# Altium schematic sheet SSR.SchDoc
size A
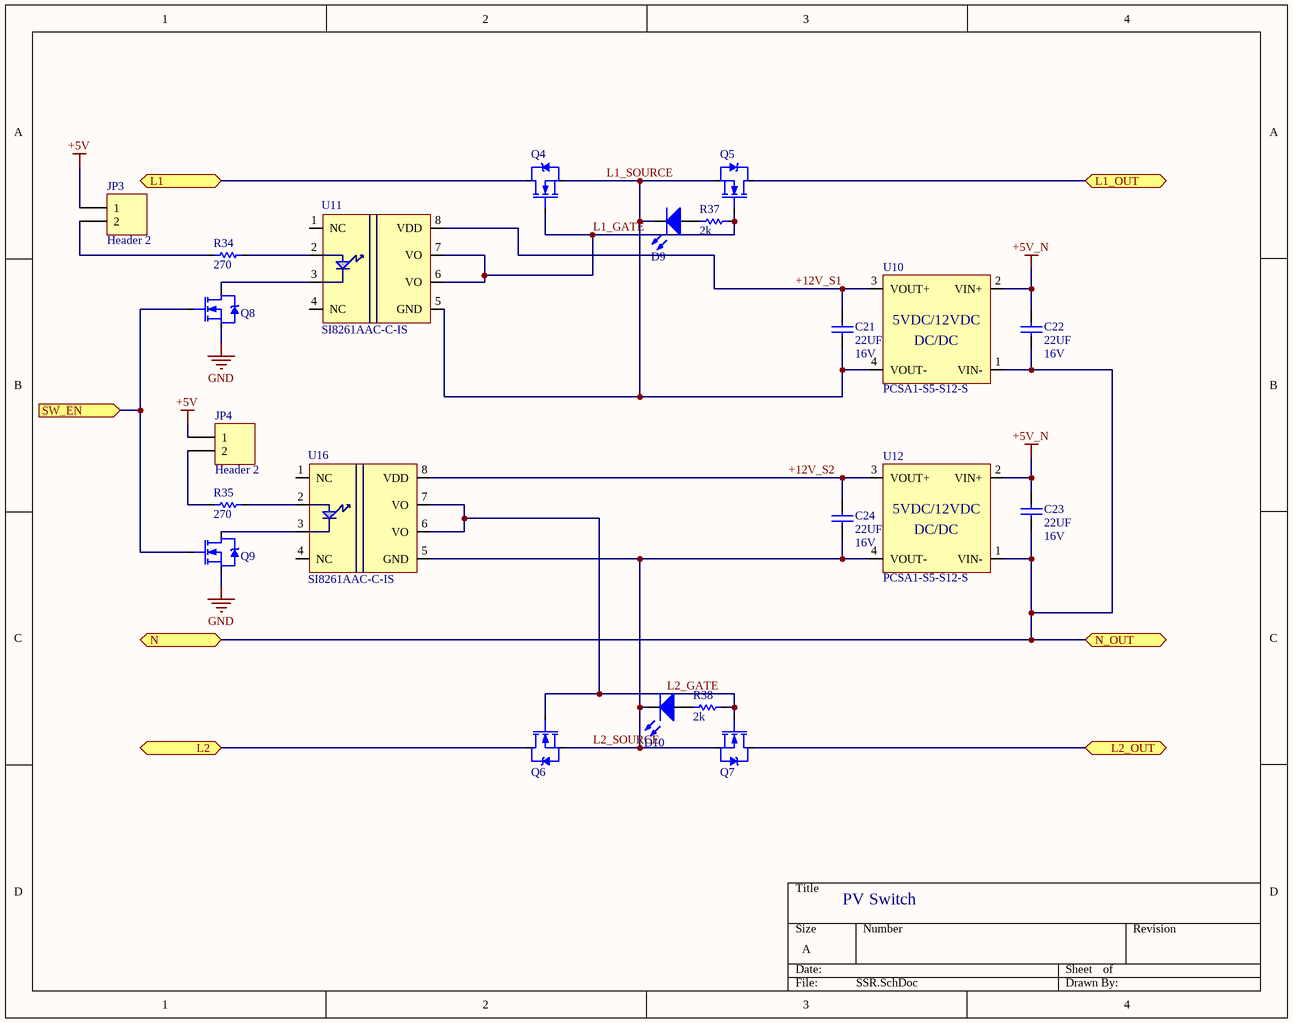
[diagram p0: SSR.SchDoc]

## Parts
C21  Capacitance: 22UF  Voltage - Rated: 16V  [CAPC3216X16N]  (hidden comment: GRM31CR61C226KE15K)
C22  Capacitance: 22UF  Voltage - Rated: 16V  [CAPC3216X16N]  (hidden comment: GRM31CR61C226KE15K)
C23  Capacitance: 22UF  Voltage - Rated: 16V  [CAPC3216X16N]  (hidden comment: GRM31CR61C226KE15K)
C24  Capacitance: 22UF  Voltage - Rated: 16V  [CAPC3216X16N]  (hidden comment: GRM31CR61C226KE15K)
D9  LTST-C190KGKT  [0603 LED]  (value not drawn)
D10  LTST-C190KGKT  [0603 LED]  (value not drawn)
JP3  Header 2  [HDR1X2]
JP4  Header 2  [HDR1X2]
Q4  STB42N60M2-EP  [D2PAK]  (value not drawn)
Q5  STB42N60M2-EP  [D2PAK]  (value not drawn)
Q6  STB42N60M2-EP  [D2PAK]  (value not drawn)
Q7  STB42N60M2-EP  [D2PAK]  (value not drawn)
Q8  NTR5103NT1G  [SOT95P237X111-3N]  (value not drawn)
Q9  NTR5103NT1G  [SOT95P237X111-3N]  (value not drawn)
R34  Resistance: 270  [RESC1608X06N]  (hidden comment: RC0603JR-07270RL)
R35  Resistance: 270  [RESC1608X06N]  (hidden comment: RC0603JR-07270RL)
R37  Resistance: 2k  [RESC1608X06N]  (hidden comment: RC0603FR-072KL)
R38  Resistance: 2k  [RESC1608X06N]  (hidden comment: RC0603FR-072KL)
U10  PCSA1-S5-S12-S  [PCSA1-S5-S12-S]
U11  SI8261AAC-C-IS  [SOIC-8]
U12  PCSA1-S5-S12-S  [PCSA1-S5-S12-S]
U16  SI8261AAC-C-IS  [SOIC-8]

## Ports
L1 (bidir), L1_OUT (bidir), L2 (bidir), L2_OUT (bidir), N (bidir), N_OUT (bidir), SW_EN (in)

## Nets
+5V: JP3.1 JP4.1
+5V_N: C22.2 C23.2 U10.2(VIN+) U12.2(VIN+)
GND: Q8.2(S) Q9.2(S)
+12V_S1: C21.2 U10.3(VOUT+) U11.8(VDD)
+12V_S2: C24.2 U12.3(VOUT+) U16.8(VDD)
L1: Q4.2(D) ; port L1
L1_GATE: Q4.1(G) Q5.1(G) R37.2 U11.6(VO) U11.7(VO)
L1_OUT: Q5.2(D) ; port L1_OUT
L1_SOURCE: C21.1 D9.2(K) Q4.3(S) Q5.3(S) U10.4(VOUT-) U11.5(GND)
L2: Q6.2(D) ; port L2
L2_GATE: Q6.1(G) Q7.1(G) R38.2 U16.6(VO) U16.7(VO)
L2_OUT: Q7.2(D) ; port L2_OUT
L2_SOURCE: C24.1 D10.2(K) Q6.3(S) Q7.3(S) U12.4(VOUT-) U16.5(GND)
N: C22.1 C23.1 U10.1(VIN-) U12.1(VIN-) ; port N, port N_OUT
SW_EN: Q8.1(G) Q9.1(G) ; port SW_EN
NetD9_1: D9.1(A) R37.1
NetD10_1: D10.1(A) R38.1
NetJP3_2: JP3.2 R34.1
NetJP4_2: JP4.2 R35.1
NetQ8_3: Q8.3(D) U11.3(K)
NetQ9_3: Q9.3(D) U16.3(K)
NetR34_2: R34.2 U11.2(A)
NetR35_2: R35.2 U16.2(A)

Not connected (* = marked no-connect by the designer): U11 1(NC) 4(NC); U16 1(NC) 4(NC)

## Notes on the sheet
- PV Switch
- (in symbol PCSA1-S5-S12-S) 5VDC/12VDC; DC/DC

## Library data of the parts
C21-C24 = GRM31CR61C226KE15K: CAP CER 22UF 16V X5R 1206; Manufacturer: Murata Electronics North America; Manufacturer Part Number: GRM31CR61C226KE15K; Supplier 1: Digi-Key; Supplier Part Number 1: 490-6512-1-ND
D9 D10 = LTST-C190KGKT: LED GREEN CLEAR 0603 SMD; Manufacturer: Lite-On Inc.; Manufacturer Part Number: LTST-C190KGKT; Supplier 1: Digi-Key; Supplier Part Number 1: 160-1435-1-ND
JP3 JP4 = Header 2: Header, 2-Pin; Manufacturer: Sullins Connector Solutions; Manufacturer Part Number: PBC36SAAN; Supplier 1: Digi-Key; Supplier Part Number 1: S1011E-36-ND
Q4-Q7 = STB42N60M2-EP: MOSFET N-CH 600V 34A EP D2PAK; Manufacturer: STMicroelectronics; Vdss(max): 600V; Manufacturer Part Number: STB42N60M2-EP; Supplier 1: Digi-Key; Supplier Part Number 1: 497-15896-1-ND
Q8 Q9 = NTR5103NT1G: MOSFET N-CH 60V 0.26A SOT23; Manufacturer: ON Semiconductor; Vdss(max): 60V; Manufacturer Part Number: NTR5103NT1G; Supplier 1: Digi-Key; Supplier Part Number 1: NTR5103NT1GOSCT-ND
R34 R35 = RC0603JR-07270RL: RES SMD 270 OHM 5% 1/10W 0603; Manufacturer: Yageo; Manufacturer Part Number: RC0603JR-07270RL; Supplier 1: Digi-Key; Supplier Part Number 1: 311-270GRCT-ND
R37 R38 = RC0603FR-072KL: RES SMD 2K OHM 1% 1/10W 0603; Manufacturer: Yageo; Manufacturer Part Number: RC0603FR-072KL; Supplier 1: Digi-Key; Supplier Part Number 1: 311-2.00KHRCT-ND
U10 U12 = PCSA1-S5-S12-S: DC/DC CONVERTER 5V-12V 1W; Manufacturer: CUI Inc.; Voltage - Input (Min): 4.5V; Voltage - Input (Max): 5.5V; Voltage - Output: 12V; Manufacturer Part Number: PCSA1-S5-S12-S; Power (Watts): 1W; Supplier 1: Digi-Key; Supplier Part Number 1: 102-3947-ND
U11 U16 = SI8261AAC-C-IS: DGTL ISO 3.75KV GATE DRVR 8SOIC; Manufacturer: Silicon Labs; Manufacturer Part Number: SI8261AAC-C-IS; Supplier 1: Digi-Key; Supplier Part Number 1: SI8261AAC-C-IS-ND